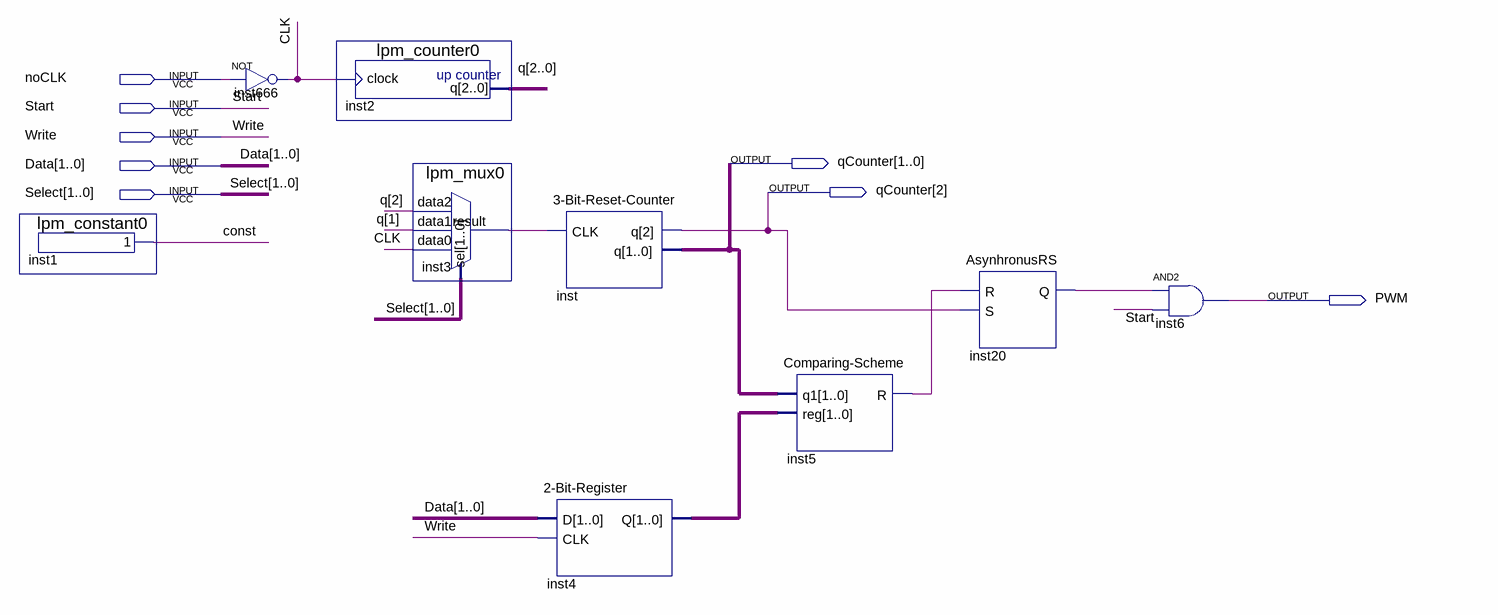
[diagram p0: schematic sheet]
// Quartus schematic Converter-2-Bit-Parallel-Code-To-PWM.bdf as structural Verilog: 9 symbols, 8 pins
module \Converter-2-Bit-Parallel-Code-To-PWM  (
  input  noCLK,
  input  Start,
  input  Write,
  input  [1:0] Data,
  input  [1:0] Select,
  output [2:0] qCounter,
  output PWM
);

  wire CLK, \const , inst3_result, inst5_r, inst20_q;
  wire [1:0] inst4_q;
  wire [2:0] q;

  lpm_constant0 inst1 (.result(\const ));
  not inst666 (CLK, noCLK);
  lpm_counter0 inst2 (.clock(CLK), .q(q));
  lpm_mux0 inst3 (.data2(q[2]), .data1(q[1]), .data0(CLK), .sel(Select), .result(inst3_result));
  \3-Bit-Reset-Counter  inst (.CLK(inst3_result), .q(qCounter));
  \2-Bit-Register  inst4 (.D(Data), .CLK(Write), .Q(inst4_q));
  \Comparing-Scheme  inst5 (.q1(qCounter[1:0]), .\reg (inst4_q), .R(inst5_r));
  AsynhronusRS inst20 (.R(inst5_r), .S(qCounter[2]), .Q(inst20_q));
  and inst6 (PWM, inst20_q, Start);
endmodule
